# Altium schematic sheet extruder.SchDoc
size A
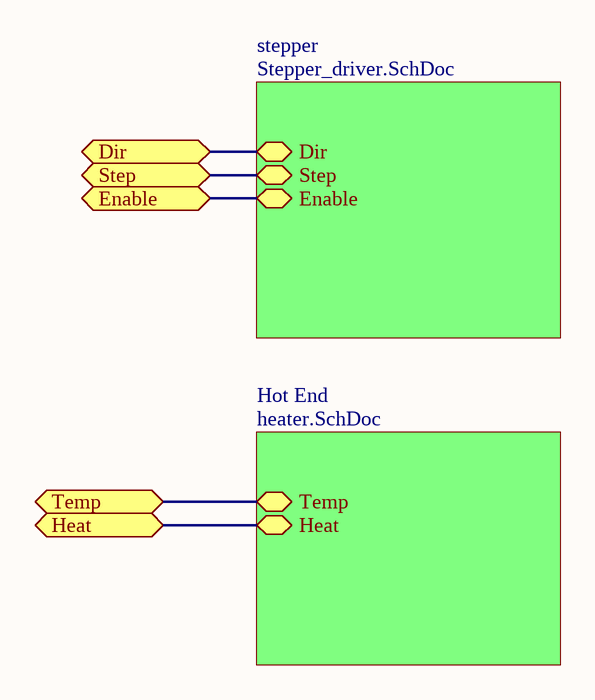
[diagram p0: extruder.SchDoc]

## Sub-sheets
Hot End = heater.SchDoc: Temp, Heat
stepper = Stepper_driver.SchDoc: Dir, Step, Enable

## Ports
Dir, Enable, Heat, Step, Temp

## Nets
Dir: port Dir, sheet stepper/Dir
Enable: port Enable, sheet stepper/Enable
Heat: port Heat, sheet Hot End/Heat
Step: port Step, sheet stepper/Step
Temp: port Temp, sheet Hot End/Temp